# Altium project Simple DOC converter.PrjPcb
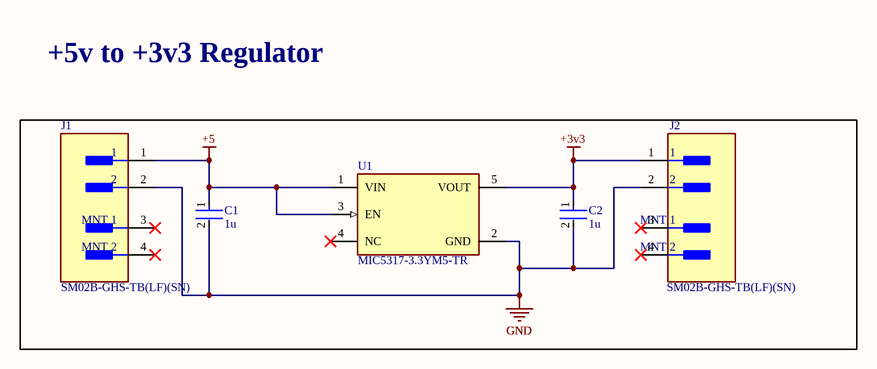
[diagram p0: LDO Schematic Altium.SchDoc]
1 sheet, 5 parts. Net scope: global (net labels, ports and power ports of the same name join across sheets).
Board file: LDO-PCB.PcbDoc

## Sheet LDO Schematic Altium.SchDoc
size A4; SheetNumber: 1; SheetTotal: 1

### Parts
C1  1u  [FP-CC0805-0_85-MFG]
C2  1u  [FP-CC0805-0_85-MFG]
J1  SM02B-GHS-TB(LF)(SN)  [FP-SM02B-GHS-TB_LF_SN-MFG]
J2  SM02B-GHS-TB(LF)(SN)  [FP-SM02B-GHS-TB_LF_SN-MFG]
U1  MIC5317-3.3YM5-TR  [FP-SOT23-5LD-PL-1-MFG]

### Nets
+3v3: C2.1 J2.1 U1.5(VOUT)
+5: C1.1 J1.1 U1.1(VIN) U1.3(EN)
GND: C1.2 C2.2 J1.2 J2.2 U1.2(GND)

Not connected (* = marked no-connect by the designer): J1 3(MNT_1)* 4(MNT_2)*; J2 3(MNT_1)* 4(MNT_2)*; U1 4(NC)*

### Notes on the sheet
- +5v to +3v3 Regulator

### Library data of the parts
C1 C2 = CMP-03422-000816-1: CAP CER 1UF 6.3V X5R 0805; Manufacturer: Yageo; Manufacturer Part Number: CC0805KKX5R5BB105; Description: CC0805 1 uF X5R 10.00% 6.3 V; Material: Ceramic; Tolerance: 0.1; Device Class L1: Passive Components; Temperature Characteristic: X5R; Voltage Rating: 6.3 V; Footprint Url: http://www.yageo.com/exep/pages/download/literatures/UPY-C_GEN_24.pdf; Value: 1 uF; Package: CC0805-0.85; Temperature Range High: +85°C; Height: 0.95mm; Temperature Range Low: -30°C; Lead Free: Yes; RoHS: TRUE; Octopart: https://octopart.com/cc0805kkx5r5bb105-yageo-71334571; Capacitance: 1 uF; Ipc Land Pattern Name: CAPC200125X85; Category: Cap; Digikey Description: CAP CER 1UF 6.3V X5R 0805; ComponentLink2URL: http://www.yageo.com/documents/recent/UPY-GPHC_Y5V_6.3V-to-50V_8.pdf; Automotive: No; Device Class L2: Capacitors; ComponentLink2Description: Datasheet; Device Class L3: Ceramic Capacitors; Temperature: -30°C to +85°C
J1 J2 = CMP-2000-07076-2: CONN HEADER SMD R/A 2POS 1.25MM; Voltage Rating: 50V; Number of Positions: 2; Pitch: 0.049inch; Current Rating: 1A; Connector Type: Outer Shroud Contact; Number of Rows: 1; Contact Material: Bronze; Termination: Solder; Color: Natural; Package Quantity: 2500; Mount: Surface Mount; Housing Color: Natural; Number of Contacts: 2; Packaging: Tape and Reel; Lead Free: Lead Free; Housing Material: Nylon; Orientation: Right Angle; Contact Type: Male Pin; Contact Plating: Tin; Series: GH; Fastening Type: Latch
U1 = CMP-06324-000116-1: IC REG LINEAR 3.3V 150MA SOT23-5; Max Input Voltage: 6V; Number of Regulators: 1; Min Current Limit: 200mA; Dropout Voltage: 155mV; Min Input Voltage: 2.5V; Power Supply Rejection Ratio (PSRR): 70dB; Case/Package: SOT-23-5; Output Voltage: 3.3V; Series: -; Max Operating Temperature: 125°C; Package Quantity: 3000; Mount: Surface Mount; Packaging: Tape and Reel; RoHS Compliant: No; Output Current: 150mA; Min Operating Temperature: -40°C; Number of Outputs: 1